# Altium schematic sheet [05] - POWER.SchDoc
size A4; Projectnumber: OWN-000; Size: A4; Contact: datasystem.pl
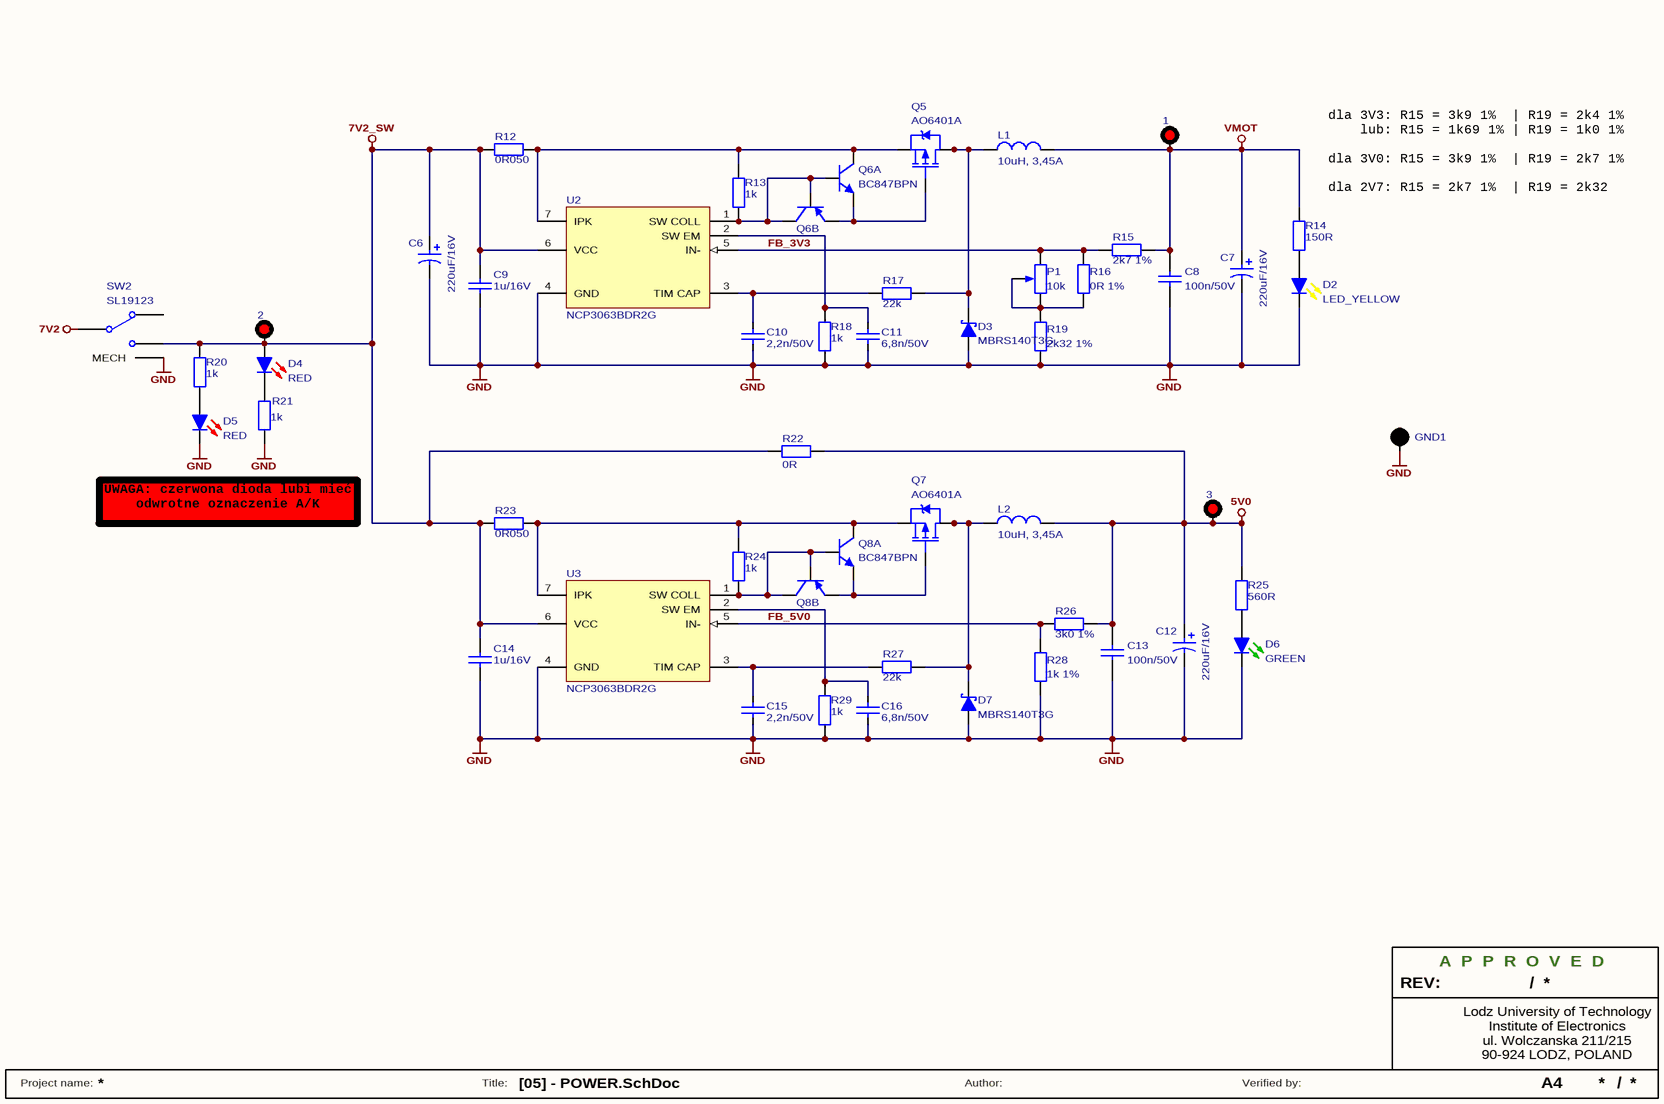
[diagram p0: [05] - POWER.SchDoc]

## Parts
1  Keystone 5000 Test Point (RED)  [Keystone_5000_RED]  (value not drawn)
2  Keystone 5000 Test Point (RED)  [Keystone_5000_RED]  (value not drawn)
3  Keystone 5000 Test Point (RED)  [Keystone_5000_RED]  (value not drawn)
C6  220uF/16V  [CES_E_8.3x8.3_6.2]
C7  220uF/16V  [CES_E_8.3x8.3_6.2]
C8  100n/50V  [C0805]
C9  1u/16V  [C0805]
C10  2,2n/50V  [C0805]
C11  6,8n/50V  [C0805]
C12  220uF/16V  [CES_E_8.3x8.3_6.2]
C13  100n/50V  [C0805]
C14  1u/16V  [C0805]
C15  2,2n/50V  [C0805]
C16  6,8n/50V  [C0805]
D2  LED_YELLOW  [LED0805Y]
D3  MBRS140T3G  [SMB]
D4  RED  [LED0805R]
D5  RED  [LED0805R]
D6  GREEN  [LED0805G]
D7  MBRS140T3G  [SMB]
GND1  Keystone 5001 Test Point (BLACK)  [Keystone_5001_BLACK]  (value not drawn)
L1  10uH, 3,45A  [PSDB1005]
L2  10uH, 3,45A  [PSDB1005]
P1  10k  [3364W]
Q5  AO6401A  [SOT-23-6]
Q6  BC847BPN  [SOT-323-6 (SOT-363, SC88, SC70-6)]  (parts A,B of 2)
Q7  AO6401A  [SOT-23-6]
Q8  BC847BPN  [SOT-323-6 (SOT-363, SC88, SC70-6)]  (parts A,B of 2)
R12  0R050  [R0805]
R13  1k  [R0805]
R14  150R  [R0805]
R15  2k7 1%  [R0805]
R16  0R 1%  [R0805]
R17  22k  [R0805]
R18  1k  [R0805]
R19  2k32 1%  [R0805]
R20  1k  [R0805]
R21  1k  [R0805]
R22  0R  [R1206]
R23  0R050  [R0805]
R24  1k  [R0805]
R25  560R  [R0805]
R26  3k0 1%  [R0805]
R27  22k  [R0805]
R28  1k 1%  [R0805]
R29  1k  [R0805]
SW2  SL19123  [500SSPxS1M6xEA]
U2  NCP3063BDR2G  [SO8]
U3  NCP3063BDR2G  [SO8]

## Nets
5V0: 3.0 C12.1 C13.2 L2.2 R22.2 R25.1 R26.2
7V2: SW2.2
7V2_SW: 2.0 C6.1 C9.2 C14.2 D4.1(A) R12.1 R20.1 R22.1 R23.1 SW2.3 U2.6(VCC) U3.6(VCC)
GND: C6.2 C7.2 C8.1 C9.1 C10.1 C11.1 C12.2 C13.1 C14.1 C15.1 C16.1 D2.2(K) D3.1(A) D5.2(K) D6.2(K) D7.1(A) GND1.0 R18.2 R19.2 R21.2 R28.2 R29.2 SW2.M(MECH) U2.4(GND) U3.4(GND)
VMOT: 1.0 C7.1 C8.2 L1.2 R14.1 R15.2
FB_3V3: P1.1(TOP) R15.1 R16.1 U2.5(IN-)
FB_5V0: R26.1 R28.1 U3.5(IN-)
NetC10_2: C10.2 R17.2 U2.3(TIM_CAP)
NetC11_2: C11.2 R18.1 U2.2(SW_EM)
NetC15_2: C15.2 R27.2 U3.3(TIM_CAP)
NetC16_2: C16.2 R29.1 U3.2(SW_EM)
NetD2_1: D2.1(A) R14.2
NetD3_2: D3.2(K) L1.1 Q5.1(D) Q5.2(D) Q5.5(D) Q5.6(D) R17.1
NetD4_2: D4.2(K) R21.1
NetD5_1: D5.1(A) R20.2
NetD6_1: D6.1(A) R25.2
NetD7_2: D7.2(K) L2.1 Q7.1(D) Q7.2(D) Q7.5(D) Q7.6(D) R27.1
NetP1_2: P1.2(BOT) P1.3(TAP) R16.2 R19.1
NetQ5_3: Q5.3(G) Q6.1(EA) Q6.4(EB)
NetQ5_4: Q5.4(S) Q6.6(CA) R12.2 R13.1 U2.7(IPK)
NetQ6_2: Q6.2(BA) Q6.3(CB) Q6.5(BB) R13.2 U2.1(SW_COLL)
NetQ7_3: Q7.3(G) Q8.1(EA) Q8.4(EB)
NetQ7_4: Q7.4(S) Q8.6(CA) R23.2 R24.1 U3.7(IPK)
NetQ8_2: Q8.2(BA) Q8.3(CB) Q8.5(BB) R24.2 U3.1(SW_COLL)

Not connected (* = marked no-connect by the designer): SW2 1

## Notes on the sheet
- (near R14) dla 3V3: R15 = 3k9 1%  | R19 = 2k4 1%
  lub: R15 = 1k69 1% | R19 = 1k0 1%
  dla 3V0: R15 = 3k9 1%  | R19 = 2k7 1%
  dla 2V7: R15 = 2k7 1%  | R19 = 2k32 1%
- UWAGA: czerwona dioda lubi mieć odwrotne oznaczenie A/K
- REV:
- A  P  P  R  O  V  E  D
- /
- Lodz University of Technology
- ul. Wolczanska 211/215
- 90-924 LODZ, POLAND
- Institute of Electronics
- Project name:
- Title:
- Author:
- Verified by:

## Library data of the parts
1-3 = Keystone 5000 Test Point
C6 C7 C12 = Cap Pol: Polarized Capacitor; ComponentLink1Description: datasheet; ComponentLink2Description: supplier; Value: 220uF/16V
C8-C11 C13-C16 = Cap: Capacitor; ComponentLink1Description: datasheet; ComponentLink2Description: supplier
  C8 C13: Value: 100n/50V
  C9 C14: Value: 1u/16V
  C10 C15: Value: 2,2n/50V
  C11 C16: Value: 6,8n/50V
D2 = LED_YELLOW: YELLOW LED; Published: 04-Apr-2006
D3 D7 = MBRS140T3G: Schottky barrier rectifier: 40V, 1A; Published: 22-Nov-2006; PackageReference: SMB; Supplier 1: TME; Supplier 2: Farnell; Supplier Part Number 1: MBRS140T3G; Supplier Part Number 2: 1467526
D4 D5 = LED_RED: RED LED; Published: 04-Apr-2006
D6 = LED_GREEN: GREEN LED; Published: 04-Apr-2006
GND1 = Keystone 5001 Test Point
L1 L2 = PSDB1005NT100: 10uH, 20%, 3,45A, PSDB1005N Series Inductor; Published: 08-Mar-2006; ComponentLink1Description: datasheet; ComponentLink2Description: supplier; Supplier 1: TME; Supplier Part Number 1: PSDB1005NT100; Value: 10uH, 3,45A
P1 = 3364W-1-103E: Published: 21-10-2009; ComponentLink1Description: datasheet; ComponentLink2Description: supplier; Value: 10k
Q5 Q7 = AO6401A: P-Channel MOSFET; -60V, -5A, 1.3W;; Supplier 1: TME; Supplier Part Number 1: AO6401A
Q6 Q8 = BC847BPN: PNP/NPN General Purpose Transistor (VCE=45V, IC=100mA); Supplier 1: TME; Supplier 2: Farnell; Supplier 3: Farnell; Supplier 4: Farnell; Supplier Part Number 1: BC847BPN.115; Supplier Part Number 2: 2336824; Supplier Part Number 3: 1081233RL; Supplier Part Number 4: 1081233
R12-R29 = Res: Resistor; Published: 19-Feb-2006; ComponentLink1Description: datasheet; ComponentLink2Description: supplier
  R12 R23: Value: 0R050
  R13 R18 R20 R21 R24 R29: Value: 1k
  R14: Value: 150R
  R15: Value: 2k7 1%
  R16: Value: 0R 1%
  R17 R27: Value: 22k
  R19: Value: 2k32 1%
  R22: Value: 0R
  R25: Value: 560R
  R26: Value: 3k0 1%
  R28: Value: 1k 1%
SW2 = SL19123: Canal Electronic SPDT AC: 3A/250V, DC: 6A/28V; Supplier 1: TME; Supplier Part Number 1: SL19123
U2 U3 = NCP3063BDR2G: DC-DC Converter NCP3063BDR2G (Farnell 1547126); Published: 22-Nov-2006; PackageReference: SO8; Supplier 1: Farnell; Supplier 2: Farnell; Supplier 3: Farnell; Supplier Part Number 1: 1547126; Supplier Part Number 2: 2126136; Supplier Part Number 3: 1547126RL